# EAGLE design logger_circuit (EAGLE 6.5.0)
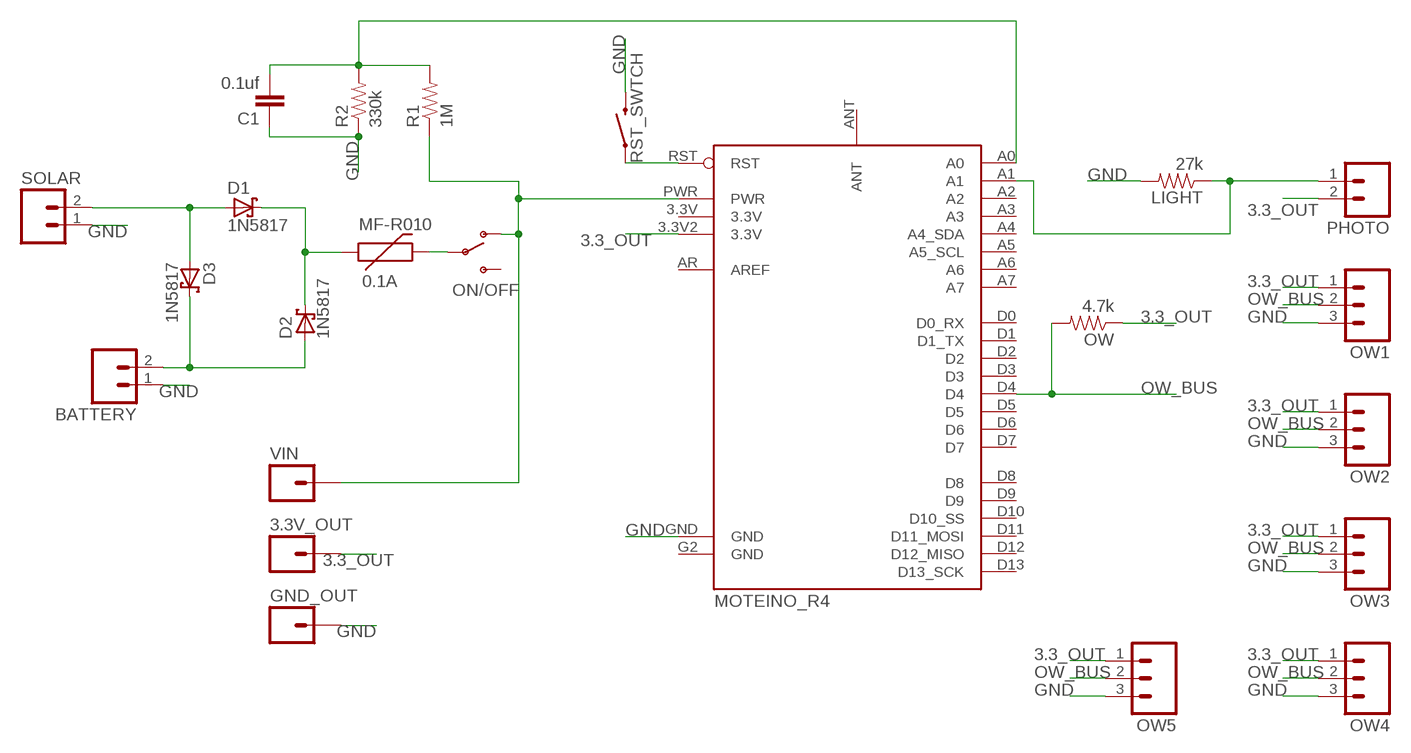
[diagram p0: schematic, sheet 1]

## Parts
3.3V_OUT  M01PTH  [1X01]
BATTERY  M02JST-PTH-2  [JST-2-PTH]
C1  0.1uf  CAPPTH1  [CAP-PTH-5MM]
D1  1N5817  1N5819-B  [DO41-7.6]
D2  1N5817  1N5819-B  [DO41-7.6]
D3  1N5817  1N5819-B  [DO41-7.6]
GND_OUT  M01PTH  [1X01]
LIGHT  27k  RESISTORPTH-1/4W  [AXIAL-0.4]
MF-R010  0.1A  PTCPTH  [PTC]
MOTEINO_R4  MOTEINO_R4_MODULEUSING_SQ_POST_PINS  [MOTEINTO_R4_SQ]
ON/OFF  SWITCH-SPDTPTH  [SWITCH-SPDT]
OW  4.7k  RESISTORPTH-1/4W  [AXIAL-0.4]
OW1  M03JST-PTH-VERT  [JST-3-PTH-VERT]
OW2  M03JST-PTH-VERT  [JST-3-PTH-VERT]
OW3  M03JST-PTH-VERT  [JST-3-PTH-VERT]
OW4  M03JST-PTH-VERT  [JST-3-PTH-VERT]
OW5  M03JST-PTH-VERT  [JST-3-PTH-VERT]
PHOTO  M02JST-PTH-VERT  [JST-2-PTH-VERT]
R1  1M  RESISTORPTH-1/4W  [AXIAL-0.4]
R2  330k  RESISTORPTH-1/4W  [AXIAL-0.4]
RST_SWTCH  SWITCH-MOMENTARY-2PTH  [TACTILE-PTH]
SOLAR  M02JST-PTH-VERT  [JST-2-PTH-VERT]
VIN  M01PTH  [1X01]

## Nets
3.3_OUT: 3.3V_OUT.1 MOTEINO_R4.3.3V2(3.3V) OW1.1 OW2.1 OW3.1 OW4.1 OW5.1 OW.P$1 PHOTO.2
GND: BATTERY.1 C1.1 GND_OUT.1 LIGHT.P$2 MOTEINO_R4.GND OW1.3 OW2.3 OW3.3 OW4.3 OW5.3 R2.P$1 RST_SWTCH.3 SOLAR.1
N$1: BATTERY.2 D2.A D3.C
N$2: D1.C D2.C MF-R010.P$1
N$3: C1.2 MOTEINO_R4.A0 R1.P$2 R2.P$2
N$4: LIGHT.P$1 MOTEINO_R4.A1 PHOTO.1
N$5: D1.A D3.A SOLAR.2
N$6: MOTEINO_R4.RST RST_SWTCH.1
N$7: MOTEINO_R4.PWR ON/OFF.1(O) R1.P$1 VIN.1
N$9: MF-R010.P$2 ON/OFF.2(P)
OW_BUS: MOTEINO_R4.D4 OW1.2 OW2.2 OW3.2 OW4.2 OW5.2 OW.P$2
Unconnected: MOTEINO_R4.3.3V MOTEINO_R4.A2 MOTEINO_R4.A3 MOTEINO_R4.A4(A4_SDA) MOTEINO_R4.A5(A5_SCL) MOTEINO_R4.A6 MOTEINO_R4.A7 MOTEINO_R4.ANT MOTEINO_R4.AR(AREF) MOTEINO_R4.D0(D0_RX) MOTEINO_R4.D1(D1_TX) MOTEINO_R4.D2 MOTEINO_R4.D3 MOTEINO_R4.D5 MOTEINO_R4.D6 MOTEINO_R4.D7 MOTEINO_R4.D8 MOTEINO_R4.D9 MOTEINO_R4.D10(D10_SS) MOTEINO_R4.D11(D11_MOSI) MOTEINO_R4.D12(D12_MISO) MOTEINO_R4.D13(D13_SCK) ON/OFF.3(S)

## Power pins joined to a net without a drawn wire
GND: MOTEINO_R4.G2(GND)

## Library data of the parts
3.3V_OUT GND_OUT VIN = SparkFun-Connectors:M01: Header 1 Standard 1-pin 0.1" header. Use with straight break away headers (SKU : PRT-00116), right angle break away headers (PRT-00553), swiss pins (PRT-00743), machine pins (PRT-00117), and female headers (PRT-00115). SMTSO-256-ET is a "flush mount" nut for a 4-40 screw. The older package used to be too tight, and did not allow it to sit properly thru the drill hit. The latest (0.165DIA) fits nice and snug.
BATTERY = SparkFun-Connectors:M02: Standard 2-pin 0.1" header. Use with - straight break away headers ( PRT-00116) - right angle break away headers (PRT-00553) - swiss pins (PRT-00743) - machine pins (PRT-00117) - female headers (PRT-00115) Molex polarized connector foot print use with: PRT-08233 with associated crimp pins and housings. 2.54_SCREWTERM for use with PRT-10571. 3.5mm Screw Terminal footprints for PRT-08084 5mm Screw Terminal footprints for use with PRT-08432; PROD_ID: CONN-09863; SKU: PRT-09914
C1 = SparkFun-Passives:CAP: Capacitor Standard 0603 ceramic capacitor, and 0.1" leaded capacitor.
D1-D3 = diode:1N581*: 1.0A SCHOTTKY BARRIER RECTIFIER Source: http://www.diodes.com/datasheets/ds23001.pdf
LIGHT OW R1 R2 = SparkFun-Resistors:RESISTOR: Resistor Basic schematic elements and footprints for 0603, 1206, and PTH resistors.
MF-R010 = SparkFun-PowerIC:PTC: Resettable Fuse PTC Resettable Fuse. Spark Fun Electronics SKU : COM-08357
MOTEINO_R4 = MoteinoR4Mod:MOTEINO_R4_MODULE: Moteino Module as a device. Available in two footprints, one with pads for 0.025" sq pins, and one using wire pins.
ON/OFF = SparkFun-Electromechanical:SWITCH-SPDT: SPDT Switch Simple slide switch, Spark Fun Electronics SKU : COM-00102 DPDT SMT slide switch, AYZ0202, SWCH-08179; PROD_ID: SWCH-08261
OW1-OW5 = SparkFun-Connectors:M03: Header 3 Standard 3-pin 0.1" header. Use with straight break away headers (SKU : PRT-00116), right angle break away headers (PRT-00553), swiss pins (PRT-00743), machine pins (PRT-00117), and female headers (PRT-00115). Molex polarized connector foot print use with SKU : PRT-08232 with associated crimp pins and housings.
PHOTO SOLAR = SparkFun-Connectors:M02: Standard 2-pin 0.1" header. Use with - straight break away headers ( PRT-00116) - right angle break away headers (PRT-00553) - swiss pins (PRT-00743) - machine pins (PRT-00117) - female headers (PRT-00115) Molex polarized connector foot print use with: PRT-08233 with associated crimp pins and housings. 2.54_SCREWTERM for use with PRT-10571. 3.5mm Screw Terminal footprints for PRT-08084 5mm Screw Terminal footprints for use with PRT-08432
RST_SWTCH = SparkFun-Electromechanical:SWITCH-MOMENTARY-2: Various NO switches- pushbuttons, reed, etc; PROD_ID: SWCH-08441

## Board
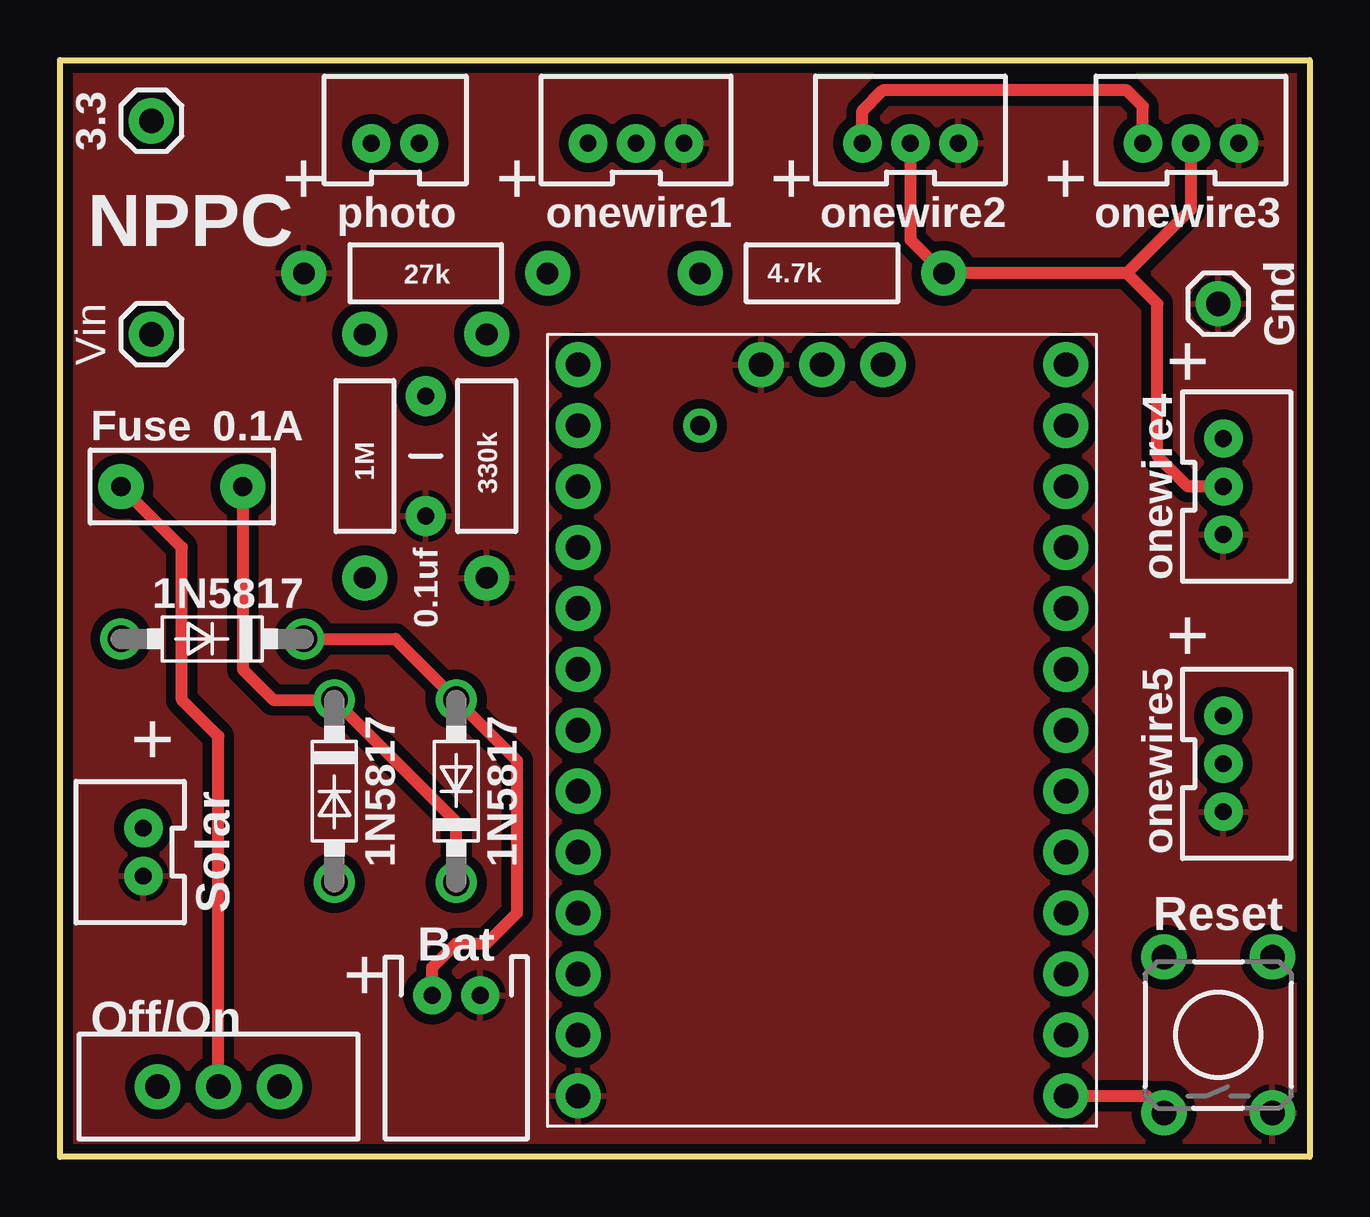
[diagram p1: board, top side]
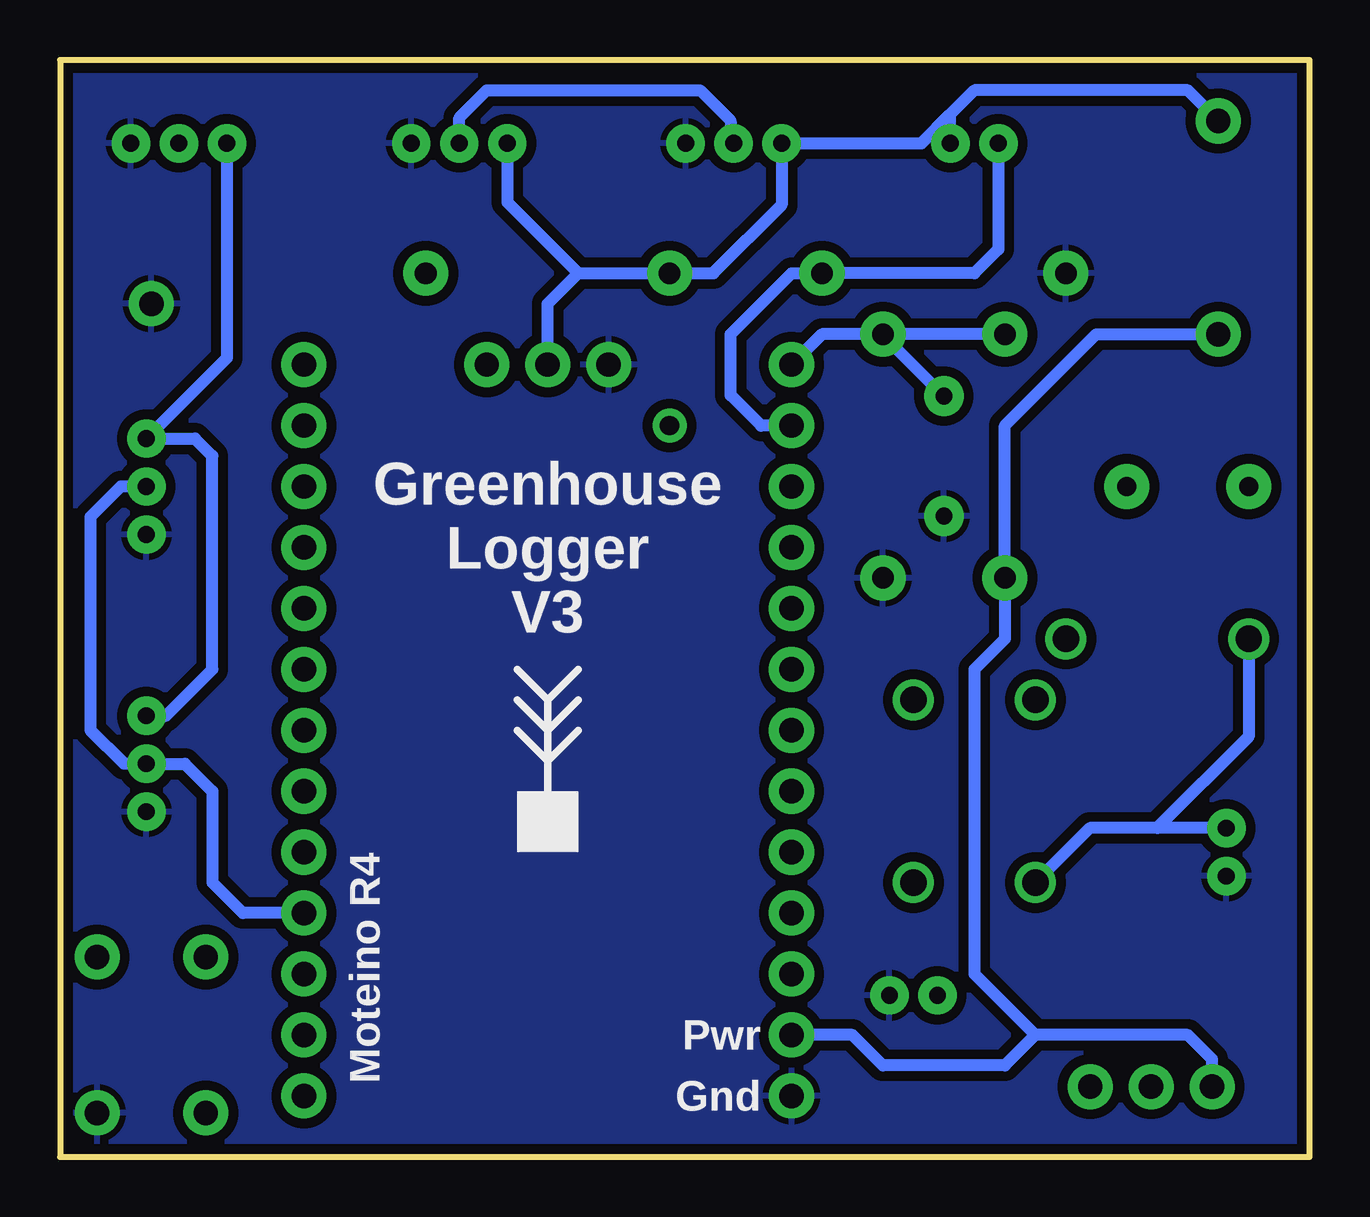
[diagram p2: board, bottom side, seen from below]

Size 52.07 x 45.72 mm. Coordinates in mm from the lower left corner, seen from the top.
Outline: 0,0 0,45.72 52.07,45.72 52.07,0 0,0
Copper layers (1*16): Top 0.035mm / dielectric 1.5mm / Bottom 0.035mm
Design rules "SparkFun": minimum track width 8mil, minimum drill 20mil, track to track 8mil, track to pad 8mil, pad to pad 8mil, via to via 8mil, smd to smd 8mil, copper to edge 10mil, drill to drill 8mil, minimum pad ring 12mil, minimum via ring 10mil, stop-mask expansion 4mil, vias tented up to drill 25mil, thermal gap 10mil

### Footprints (pad centres in the part's own frame; a part is rotated, then mirrored left to right if it is on the bottom)
1X01 = drill 1.016 pad 1.88: 1 0,0
JST-2-PTH = drill 0.7 pad 1.6: 1 -1,0; 2 1,0
CAP-PTH-5MM = drill 0.7 pad 1.651: 1 -2.5,0; 2 2.5,0
DO41-7.6 = drill 1.1 pad 1.7: A 3.81,0; C -3.81,0
AXIAL-0.4 = drill 0.9 pad 1.88: P$1 -5.08,0; P$2 5.08,0
PTC = drill 0.8 pad 1.88: P$1 -2.54,0; P$2 2.54,0
MOTEINTO_R4_SQ = drill 1.016 pad 1.88: 3.3V -10.16,10.16; 3.3V2 15.24,0; A0 15.24,10.16; A1 12.7,10.16; A2 10.16,10.16; A3 7.62,10.16; A4 5.08,10.16; A5 2.54,10.16; A6 0,10.16; A7 -2.54,10.16; AR 15.24,-2.54; D0 -5.08,10.16; D1 -7.62,10.16; D2 -12.7,-10.16; D3 -10.16,-10.16; D4 -7.62,-10.16; D5 -5.08,-10.16; D6 -2.54,-10.16; D7 0,-10.16; D8 2.54,-10.16; D9 5.08,-10.16; D10 7.62,-10.16; D11 10.16,-10.16; D12 12.7,-10.16; D13 15.24,-10.16; G2 15.24,2.54; GND -15.24,10.16; PWR -12.7,10.16; RST -15.24,-10.16 | drill 0.8: ANT 12.7,5.08
SWITCH-SPDT = drill 1.016 pad 1.88: 1 0,2.54; 2 0,0; 3 0,-2.54
JST-3-PTH-VERT = drill 0.7 pad 1.6: 1 -2,-0.55; 2 0,-0.55; 3 2,-0.55
JST-2-PTH-VERT = drill 0.7 pad 1.6: 1 -1,-0.55; 2 1,-0.55
TACTILE-PTH = drill 1.016 pad 1.88: 1 -3.251,2.261; 2 3.251,2.261; 3 -3.251,-2.261; 4 3.251,-2.261

### Placement (x,y rotation side)
3.3V_OUT  3.81,43.18 180 top
BATTERY  16.51,6.73 180 top
C1  15.24,29.21 90 top
D1  11.43,15.24 270 top
D2  16.51,15.24 90 top
D3  6.35,21.59 180 top
GND_OUT  48.26,35.56 0 top
LIGHT  15.24,36.83 180 top
MF-R010  5.08,27.94 180 top
MOTEINO_R4  31.75,17.78 90 top
ON/OFF  6.6,2.92 90 top
OW  31.75,36.83 0 top
OW1  24,42.8 0 top
OW2  35.43,42.8 0 top
OW3  47.12,42.8 0 top
OW4  49.02,27.94 270 top
OW5  49.02,16.38 270 top
PHOTO  13.97,42.8 0 top
R1  12.7,29.21 90 top
R2  17.78,29.21 90 top
RST_SWTCH  48.26,5.08 90 top
SOLAR  2.92,12.7 90 top
VIN  3.81,34.29 0 top

### Tracks (layer width: path | path; a pad name or v marks a point on that pad's centre or on a via)
3.3_OUT
  Top 0.508: OW2.1 33.43,43.59 34.29,44.45 44.45,44.45 45.12,43.78 OW3.1
  Bottom 0.508: PHOTO.2 14.97,43.45 | 14.97,43.45 13.97,44.45 5.08,44.45 3.3V_OUT.1 | MOTEINO_R4.3.3V2 31.75,35.56 30.48,36.83 | 30.48,36.83 OW.P$1 24.85,36.83 22,39.68 OW1.1 16.17,42.25 14.97,43.45 | OW2.1 33.43,39.78 30.48,36.83 | OW3.1 45.12,33.3 OW4.1 46.45,29.94 45.72,29.21 45.72,20.32 47.66,18.38 OW5.1
GND
  pour Top (isolate 0.406): 0,45.72 52.07,45.72 52.07,0 0,0
  pour Bottom (isolate 0.406): 0,45.72 52.07,45.72 52.07,0 0,0
N$1
  Top 0.508: BATTERY.2 15.51,7.89 16.51,8.89 17.78,8.89 19.05,10.16 19.05,16.51 D2.A 13.97,21.59 D3.C
N$2
  Top 0.508: D2.C 16.51,13.97 D1.C 8.89,19.05 7.62,20.32 MF-R010.P$1
N$3
  Bottom 0.508: R2.P$2 20.32,34.29 MOTEINO_R4.A0 | R1.P$2 R2.P$2 | R2.P$2 17.78,34.25 C1.2
N$4
  Bottom 0.508: PHOTO.1 12.97,37.83 13.97,36.83 LIGHT.P$1 21.59,36.83 24.13,34.29 24.13,31.75 22.86,30.48 MOTEINO_R4.A1
N$5
  Bottom 0.508: SOLAR.2 6.35,13.7 | 6.35,13.7 9.16,13.7 D1.A | D3.A 2.54,17.51 6.35,13.7
N$6
  Top 0.508: MOTEINO_R4.RST 45.29,2.54 RST_SWTCH.1
N$7
  Bottom 0.508: 11.43,5.08 5.08,5.08 4.06,4.06 ON/OFF.1 | 11.43,5.08 12.7,3.81 17.78,3.81 19.05,5.08 MOTEINO_R4.PWR | 11.43,5.08 13.97,7.62 13.97,20.32 12.7,21.59 R1.P$1 12.7,30.48 8.89,34.29 VIN.1
N$9
  Top 0.508: MF-R010.P$2 5.08,25.4 5.08,19.05 6.6,17.53 ON/OFF.2
OW_BUS
  Top 0.508: 44.45,36.83 47.12,39.5 OW3.2 | 44.45,36.83 OW.P$2 35.43,38.23 OW2.2 | OW4.2 46.99,27.94 45.72,29.21 45.72,35.56 44.45,36.83
  Bottom 0.508: OW1.2 24.13,43.18 25.4,44.45 34.29,44.45 35.43,43.31 OW2.2 | MOTEINO_R4.D4 44.45,10.16 45.72,11.43 45.72,15.24 46.86,16.38 OW5.2 49.4,16.38 50.8,17.78 50.8,26.67 49.53,27.94 OW4.2

### Text on the board
tPlace: 3.3 | + | + | + | + | NPPC | photo | onewire1 | onewire2 | onewire3 | Gnd | Vin | + | Fuse | 0.1A | onewire4 | 0.1uf | 1N5817 | + | + | onewire5 | 1N5817 | 1N5817 | Solar | Reset | Bat | + | Off/On
bPlace: Greenhouse / Logger / V3 | Moteino R4 | Pwr | Gnd